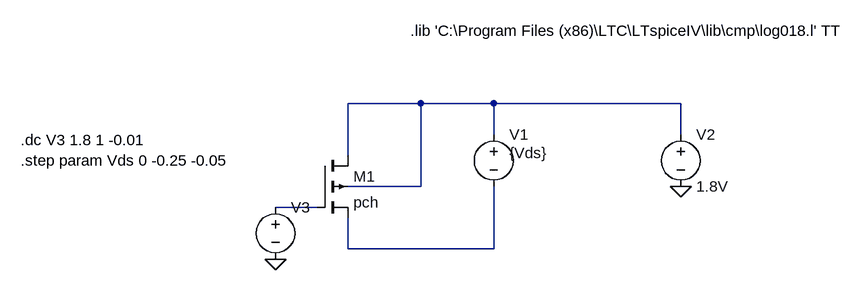
[diagram p0: schematic 180nm_parameters_PMOS.asc]
180nm_parameters_PMOS.asc, the LTspice schematic file:
Version 4
SHEET 1 1268 680
WIRE 480 -16 368 -16
WIRE 592 -16 480 -16
WIRE 880 -16 592 -16
WIRE 592 32 592 -16
WIRE 880 32 880 -16
WIRE 368 64 368 -16
WIRE 480 112 480 -16
WIRE 480 112 368 112
WIRE 320 144 256 144
WIRE 368 208 368 160
WIRE 592 208 592 112
WIRE 592 208 368 208
FLAG 880 112 0
FLAG 256 224 0
SYMBOL pmos4 320 64 R0
SYMATTR InstName M1
SYMATTR Value pch
SYMATTR Value2 l=0.5u w=19u m=12
SYMBOL voltage 592 16 R0
WINDOW 123 0 0 Left 2
WINDOW 39 0 0 Left 2
WINDOW 3 24 44 Left 2
SYMATTR InstName V1
SYMATTR Value {Vds}
SYMBOL voltage 880 16 R0
WINDOW 123 0 0 Left 2
WINDOW 39 0 0 Left 2
SYMATTR InstName V2
SYMATTR Value 1.8V
SYMBOL voltage 256 128 R0
WINDOW 123 0 0 Left 2
WINDOW 39 0 0 Left 2
SYMATTR InstName V3
SYMATTR Value ""
TEXT 464 -128 Left 2 !.lib 'C:\\Program Files (x86)\\LTC\\LTspiceIV\\lib\\cmp\\log018.l' TT
TEXT -136 40 Left 2 !.dc V3 1.8 1 -0.01
TEXT -136 72 Left 2 !.step param Vds 0 -0.25 -0.05

The netlist it stands for:
* 180nm_parameters_PMOS.asc
M1 N001 N002 N003 N001 pch l=0.5u w=19u m=12
V1 N001 N003 {Vds}
V2 N001 0 1.8V
V3 N002 0
.model NMOS NMOS
.model PMOS PMOS
.lib standard.mos
.lib 'C:\Program Files (x86)\LTC\LTspiceIV\lib\cmp\log018.l' TT
.dc V3 1.8 1 -0.01
.step param Vds 0 -0.25 -0.05
.backanno
.end